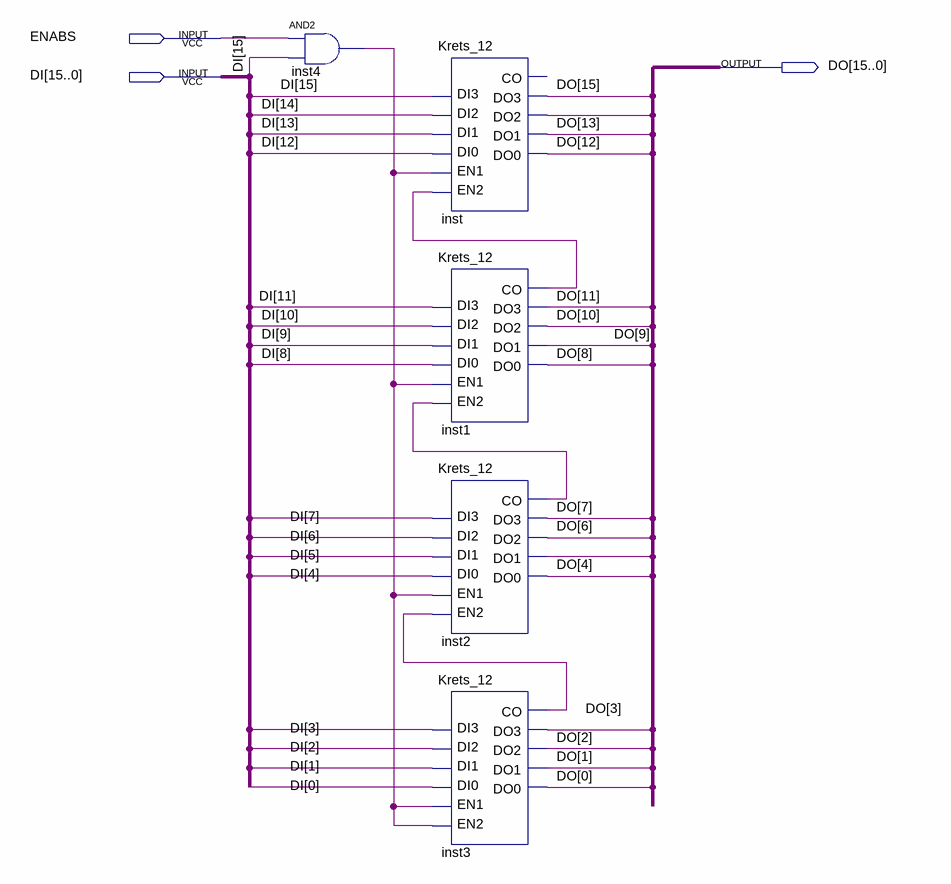
[diagram p0: schematic sheet]
// Quartus schematic ABSLT.bdf as structural Verilog: 5 symbols, 3 pins
module ABSLT (
  input  ENABS,
  input  [15:0] DI,
  output [15:0] DO
);

  wire inst1_co, inst2_co, inst2_do1, inst3_co, inst4_out, inst_do2;

  and inst4 (inst4_out, ENABS, DI[15]);
  Krets_12 inst (
    .DI3(DI[15]), .DI2(DI[14]), .DI1(DI[13]), .DI0(DI[12]), .EN2(inst1_co), .EN1(inst4_out), .DO3(DO[15]),
    .DO2(inst_do2), .DO1(DO[13]), .DO0(DO[12]));  // open: CO
  Krets_12 inst1 (
    .DI3(DI[11]), .DI2(DI[10]), .DI1(DI[9]), .DI0(DI[8]), .EN2(inst2_co), .EN1(inst4_out), .CO(inst1_co),
    .DO3(DO[11]), .DO2(DO[10]), .DO1(DO[9]), .DO0(DO[8]));
  Krets_12 inst2 (
    .DI3(DI[7]), .DI2(DI[6]), .DI1(DI[5]), .DI0(DI[4]), .EN2(inst3_co), .EN1(inst4_out), .CO(inst2_co),
    .DO3(DO[7]), .DO2(DO[6]), .DO1(inst2_do1), .DO0(DO[4]));
  Krets_12 inst3 (
    .DI3(DI[3]), .DI2(DI[2]), .DI1(DI[1]), .DI0(DI[0]), .EN2(inst4_out), .EN1(inst4_out), .CO(inst3_co),
    .DO3(DO[3]), .DO2(DO[2]), .DO1(DO[1]), .DO0(DO[0]));
endmodule
